# EAGLE schematic heatGun (EAGLE 8.3.2)
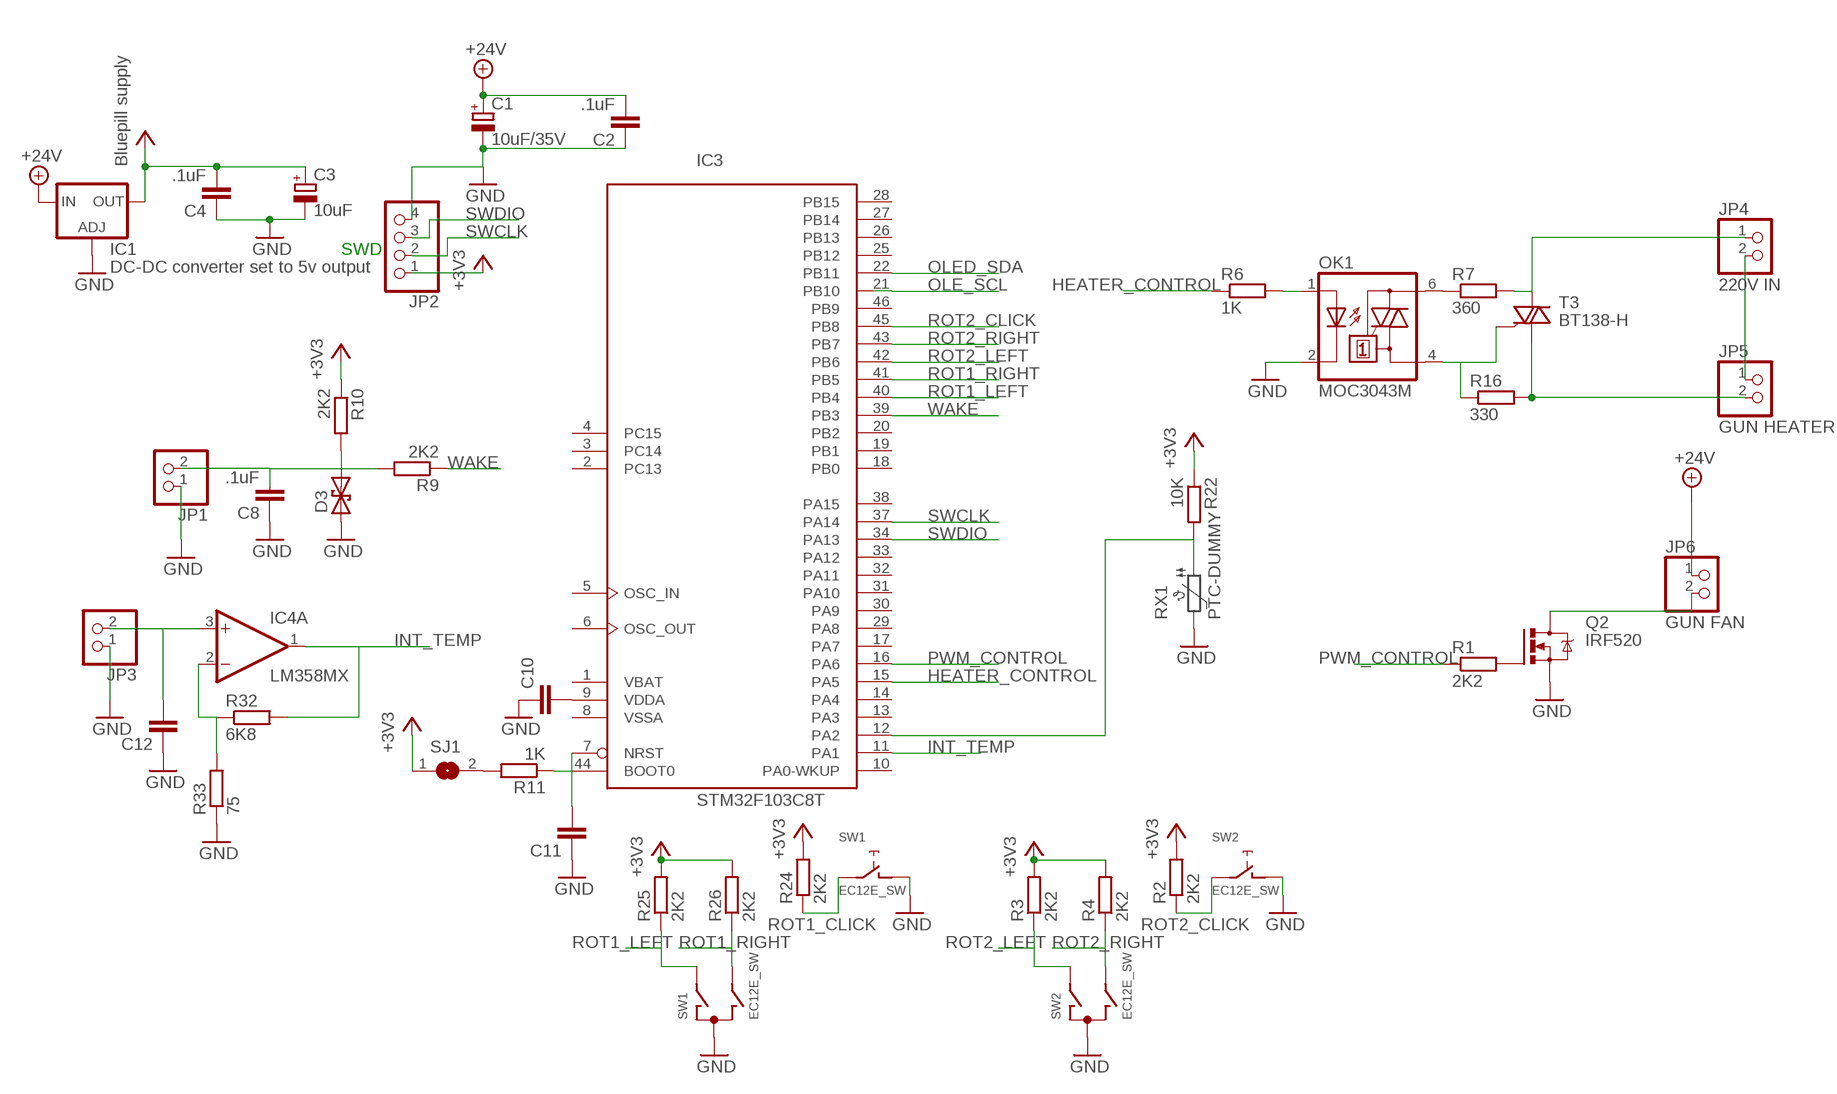
[diagram p0: schematic, sheet 1]

## Parts
C1  10uF/35V  CPOL-EUE2,5-6E  [E2,5-6E]
C2  .1uF  C-EUC0603  [C0603]
C3  10uF  CPOL-EUE2,5-6E  [E2,5-6E]
C4  .1uF  C-EUC0603  [C0603]
C8  .1uF  C-EUC0603  [C0603]
C10  C-EUC0603  [C0603]
C11  C-EUC0603  [C0603]
C12  C-EUC0603  [C0603]
D3  BZW04XXB  [F126Z12]
IC1  DC-DC converter set to 5v output  LD117AS18TR  [SOT223]
IC3  STM32F103C8T  [LQFP48]
IC4  LM358MX  [SO08]
JP1  PINHD-1X2  [1X02]
JP2  PINHD-1X4  [1X04]
JP3  PINHD-1X2  [1X02]
JP4  220V IN  PINHD-1X2  [1X02]
JP5  GUN HEATER  PINHD-1X2  [1X02]
JP6  GUN FAN  PINHD-1X2  [1X02]
OK1  MOC3043M  [DIL06]
Q2  IRF520  [TO220BV]
R1  2K2  R-EU_R0603  [R0603]
R2  2K2  R-EU_R0603  [R0603]
R3  2K2  R-EU_R0603  [R0603]
R4  2K2  R-EU_R0603  [R0603]
R6  1K  R-EU_R0603  [R0603]
R7  360  R-EU_R0603  [R0603]
R9  2K2  R-EU_R0603  [R0603]
R10  2K2  R-EU_R0603  [R0603]
R11  1K  R-EU_R0603  [R0603]
R16  330  R-EU_R0603  [R0603]
R22  10K  R-EU_R0603  [R0603]
R24  2K2  R-EU_R0603  [R0603]
R25  2K2  R-EU_R0603  [R0603]
R26  2K2  R-EU_R0603  [R0603]
R32  6K8  R-EU_R0603  [R0603]
R33  75  R-EU_R0603  [R0603]
SJ1  SJ  [SJ]
SW1  EC12E_SW  [ALPS_EC12E_SW]
SW2  EC12E_SW  [ALPS_EC12E_SW]
T3  BT138-H  [TO220BH]

## Nets
+3V3: C3.+ C4.2 IC1.4(OUT) JP2.1 R2.2 R3.2 R4.2 R10.1 R22.1 R24.2 R25.2 R26.2 SJ1.1 ; supply symbol labelled Bluepill supply
+24V: C1.+ C2.2 IC1.3(IN) JP6.1
GND: C1.- C2.1 C3.- C4.1 C8.1 C10.1 C11.1 C12.1 D3.A IC1.1(ADJ) JP1.1 JP2.4 JP3.1 OK1.2(C) Q2.S R33.1 SW1.C SW1.D SW2.C SW2.D
HEATER_CONTROL: IC3.15(PA5) R6.1
INT_TEMP: IC3.11(PA1) IC4.1(A:OUT) R32.2
N$1: Q2.G R1.2
N$3: JP6.2 Q2.D
N$10: OK1.1(A) R6.2
N$15: IC3.44(BOOT0) R11.1
N$16: R11.2 SJ1.2
N$17: C12.2 IC4.3(A:+IN) JP3.2
N$20: OK1.6(A2) R7.1
N$21: JP4.1 R7.2 T3.T2(A2)
N$24: IC3.12(PA2) R22.2
N$30: C10.2 IC3.9(VDDA)
N$31: C11.2 IC3.7(NRST)
N$32: OK1.4(A1) R16.1 T3.G
N$33: JP4.2 JP5.1
N$34: JP5.2 R16.2 T3.T1(A1)
N$35: IC4.2(A:-IN) R32.1 R33.2
OLE_SCL: IC3.21(PB10)
OLED_SDA: IC3.22(PB11)
PWM_CONTROL: IC3.16(PA6) R1.1
REED: C8.2 D3.C JP1.2 R9.2 R10.2
ROT1_CLICK: R24.1 SW1.E
ROT1_LEFT: IC3.40(PB4) R25.1 SW1.A
ROT1_RIGHT: IC3.41(PB5) R26.1 SW1.B
ROT2_CLICK: IC3.45(PB8) R2.1 SW2.E
ROT2_LEFT: IC3.42(PB6) R3.1 SW2.A
ROT2_RIGHT: IC3.43(PB7) R4.1 SW2.B
SWCLK: IC3.37(PA14) JP2.2
SWDIO: IC3.34(PA13) JP2.3
WAKE: IC3.39(PB3) R9.1
Unconnected: IC3.2(PC13) IC3.3(PC14) IC3.4(PC15) IC3.5(OSC_IN) IC3.6(OSC_OUT) IC3.10(PA0-WKUP) IC3.13(PA3) IC3.14(PA4) IC3.17(PA7) IC3.18(PB0) IC3.19(PB1) IC3.20(PB2) IC3.25(PB12) IC3.26(PB13) IC3.27(PB14) IC3.28(PB15) IC3.29(PA8) IC3.30(PA9) IC3.31(PA10) IC3.32(PA11) IC3.33(PA12) IC3.38(PA15) IC3.46(PB9) IC4.5(B:+IN) IC4.6(B:-IN) IC4.7(B:OUT) SW1.GND1(G) SW1.GND2(G) SW2.GND1(G) SW2.GND2(G)

## Notes on the sheet
- SWD

## Power pins joined to a net without a drawn wire
V+: IC4.8(P:V+)
V-: IC4.4(P:V-)
VBAT: IC3.1(VBAT)
VDD: IC3.24(VDD) IC3.36(VDD) IC3.48(VDD)
VSS: IC3.23(VSS) IC3.35(VSS) IC3.47(VSS)
VSSA: IC3.8(VSSA)

## Library data of the parts
C1 C3 = rcl:CPOL-EU: POLARIZED CAPACITOR, European symbol
C2 C4 C8 C10-C12 = rcl:C-EU: CAPACITOR, European symbol
D3 = diode:BZW04XXB: DIODE uni and bidirectional supressor diode
IC1 = v-reg:LD117A?*: Low drop fixed and adjustable positive voltage regulators 1 A Source: http://www.st.com/stonline/products/literature/ds/7194/ld1117axx.pdf
IC3 = micro-stm_v3:STM32F103C*T: ARM 32-bit Cortex™-M3 CPU 72 MHz maximum frequency 16 to 128 Kbytes of Flash memory 6 to 20 kbytes of SRAM 37 GPIOs 2.0 to 3.6 V application supply
IC4 = linear:LM358: OP AMP also LM158; LM258; LM2904 Source: http://cache.national.com/ds/LM/LM158.pdf
JP1 JP3-JP6 = pinhead:PINHD-1X2: PIN HEADER
JP2 = pinhead:PINHD-1X4: PIN HEADER
OK1 = optocoupler:MOC30*: 6-Pin DIP Zero-Cross Optoisolators Triac Driver Output (250/400 Volt Peak) Source: Data sheet <http://www.fairchildsemi.com/ds/MO/MOC3031M.pdf> The old path of data sheet not more available 2013-05-06.; MF: FAIRCHILD SEMICONDUCTOR; MPN: MOC3043-M; OC_FARNELL: 1021371; OC_NEWARK: 72K8900
Q2 = transistor-power:IRF520: HEXFET Power MOSFET
R1-R4 R6 R7 R9-R11 R16 R22 R24-R26 R32 R33 = rcl:R-EU_: RESISTOR, European symbol
SJ1 = jumper:SJ: SMD solder JUMPER
SW1 SW2 = switch-alps:EC12E_SW: ALPS rotary Encoder EC12E series with switch; MPN: EC12E2424407; OC_FARNELL: 1520813; OC_NEWARK: 74M1068
T3 = triac:BT138: TRIAC Source: http://www.semiconductors.philips.com BT138_SERIES_2.pdf